# EAGLE schematic ChaosMeter (EAGLE 6.6.0)

## Sheet 1 of 6
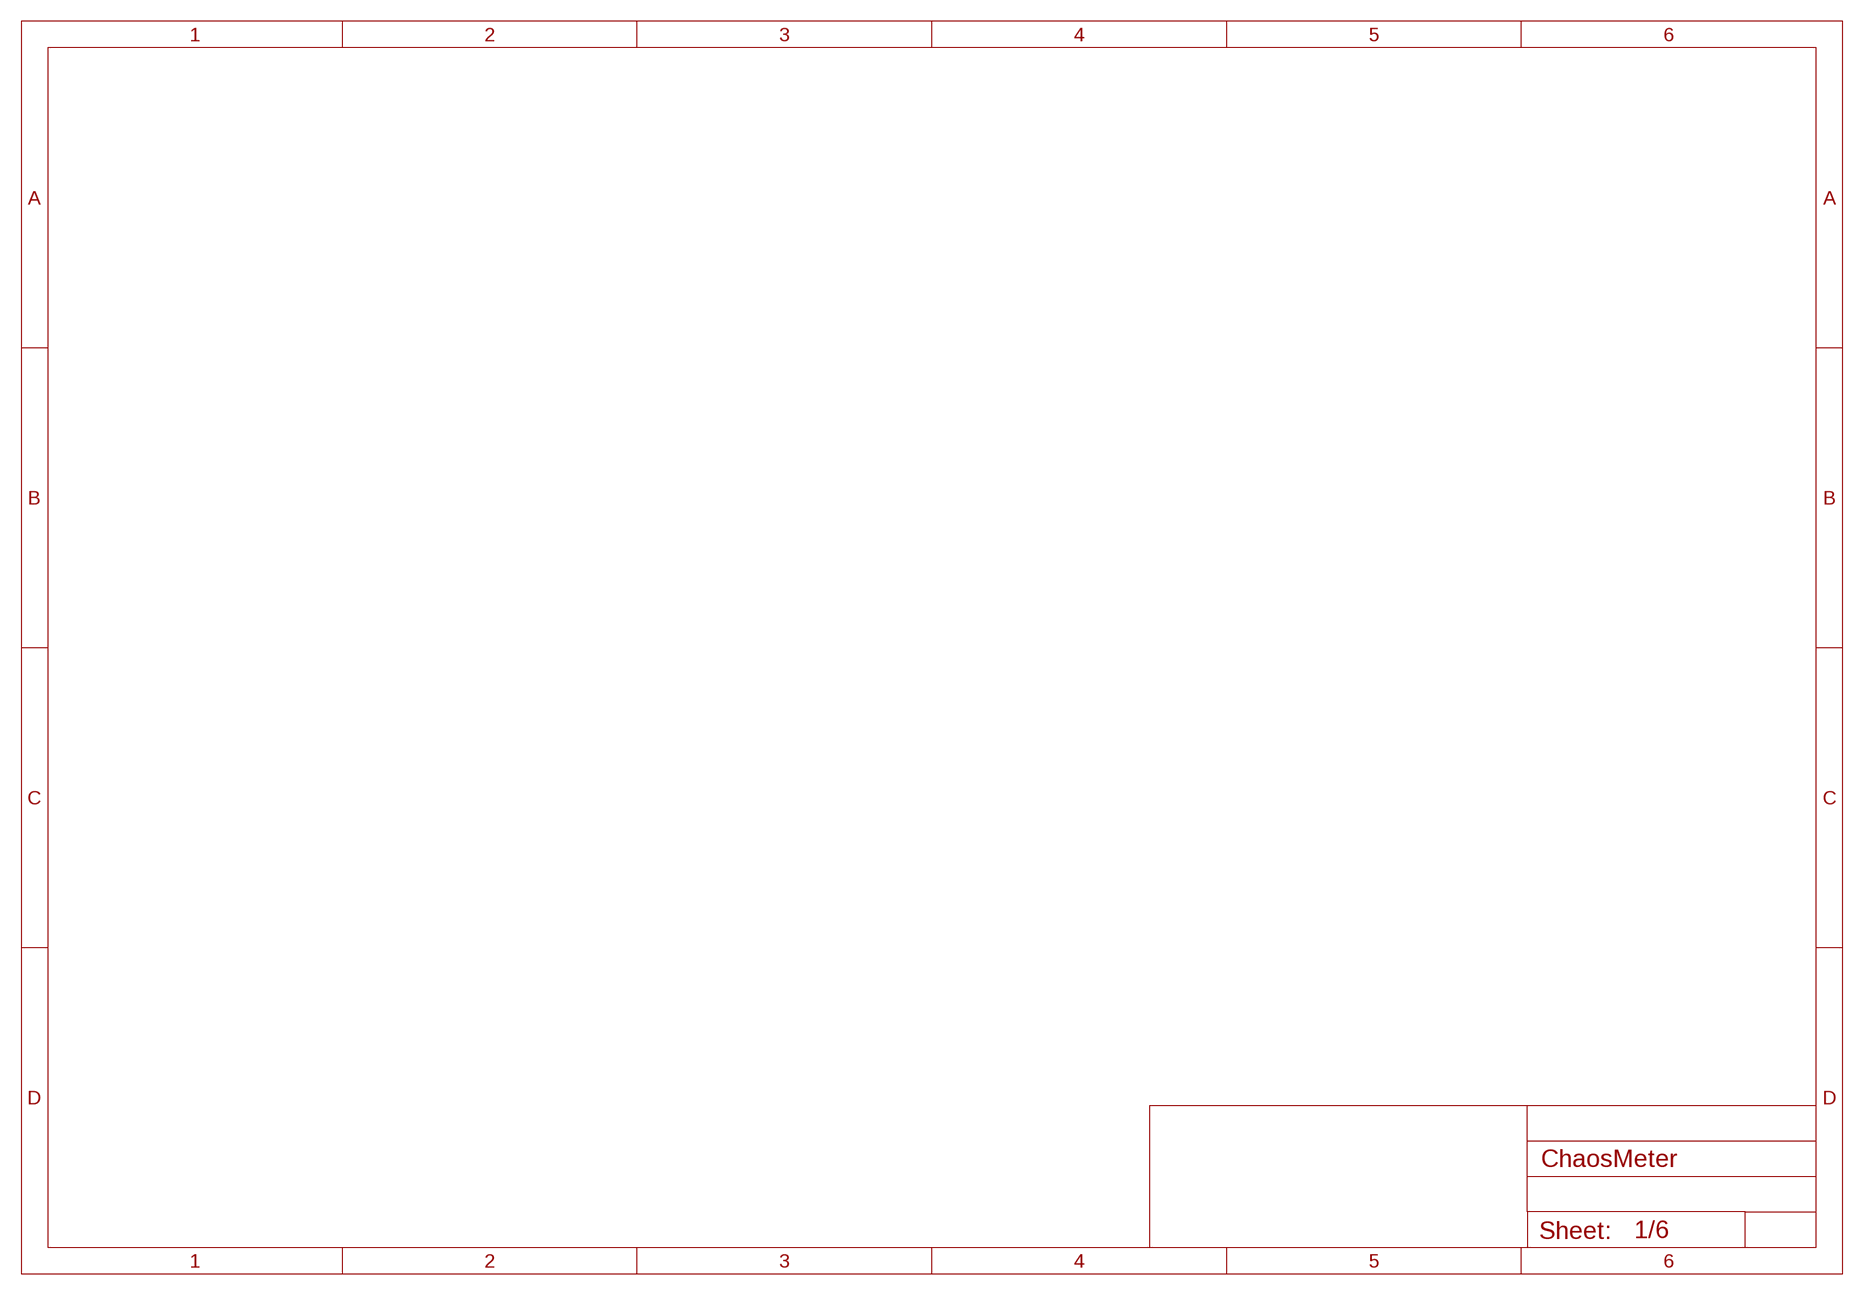
[diagram p0: schematic, sheet 1]

## Sheet 2 of 6
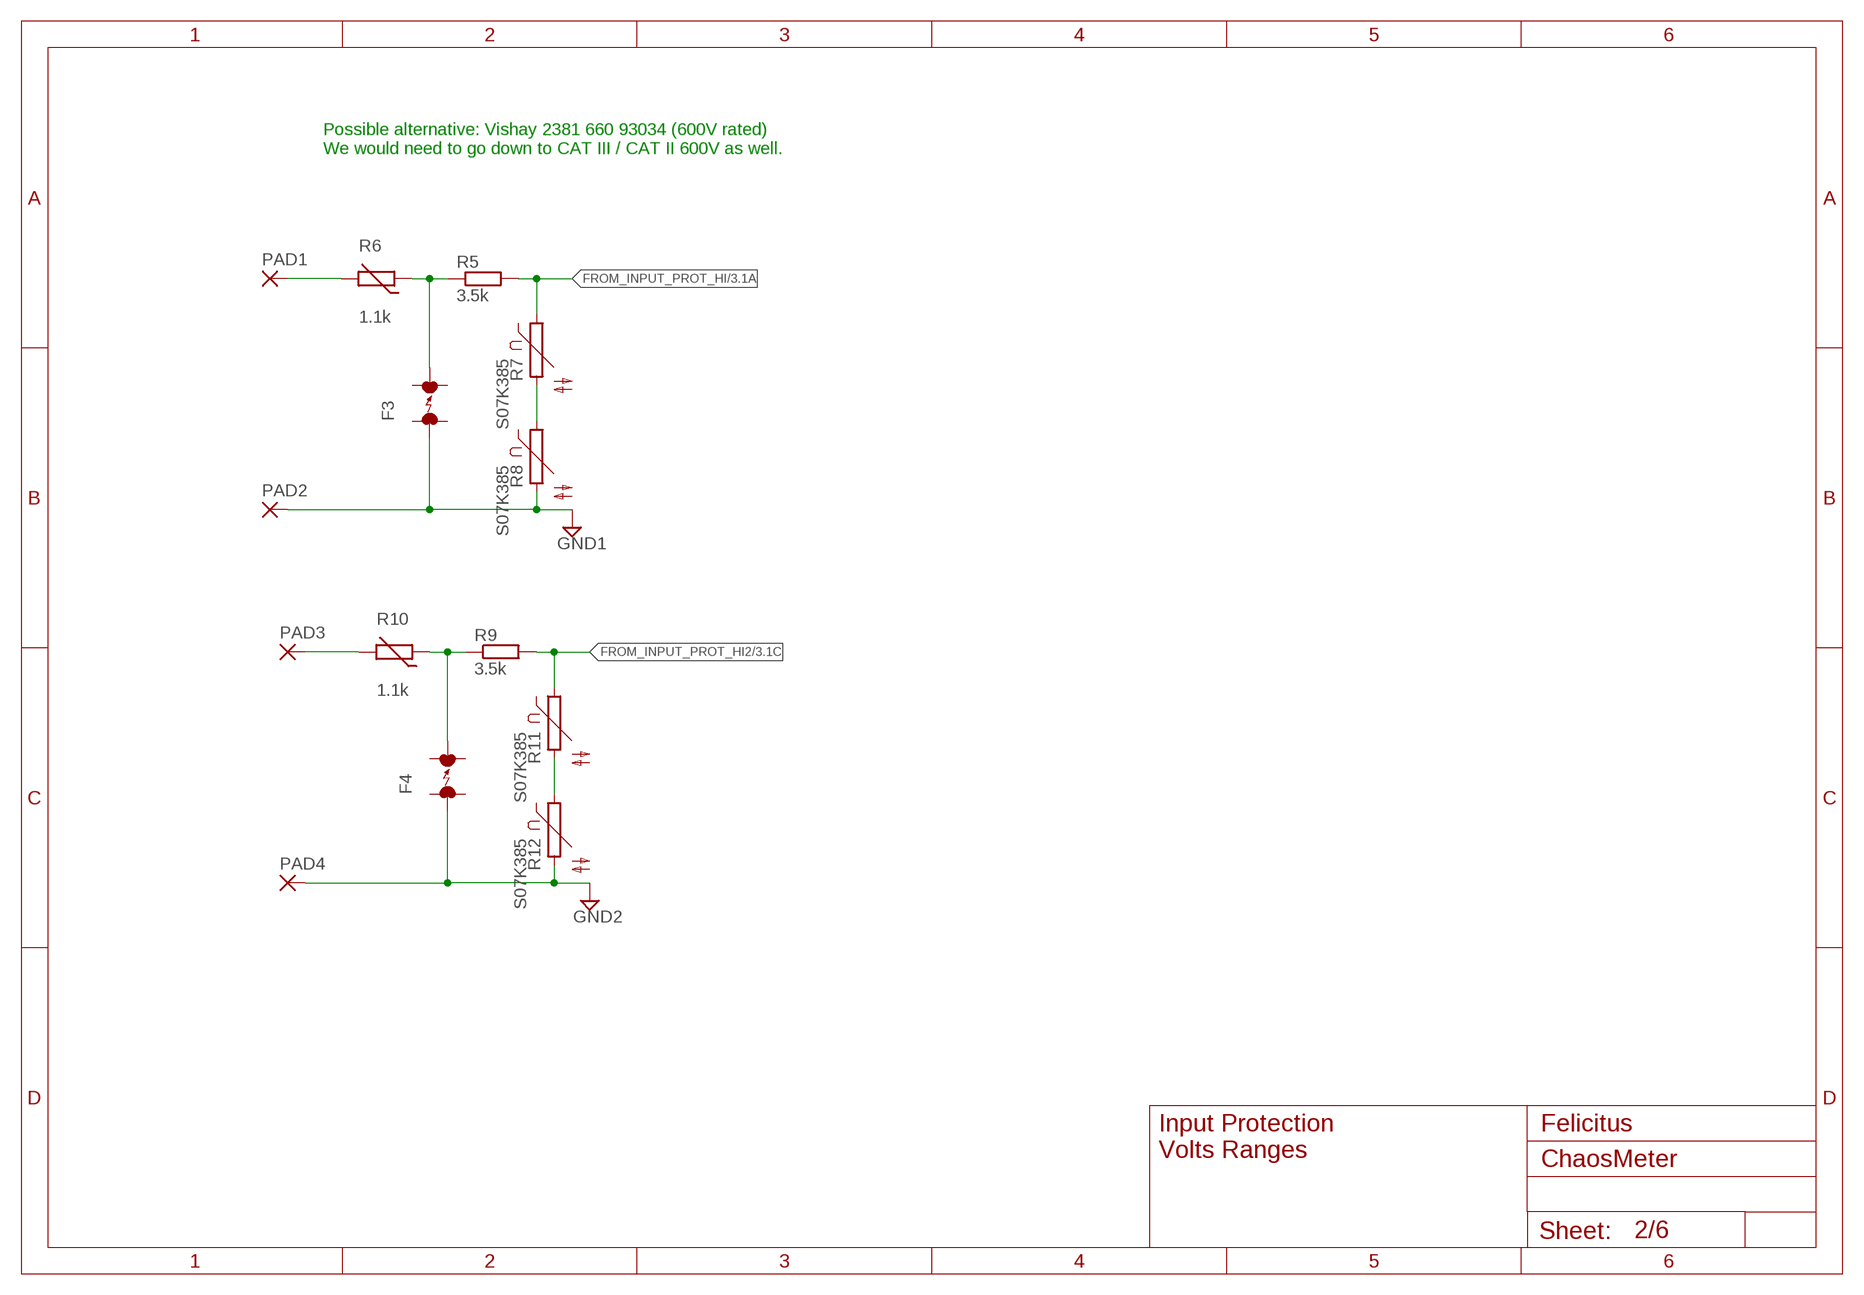
[diagram p1: schematic, sheet 2]

### Parts
F3  ARRESTER  [EPCOS_N81]
F4  ARRESTER  [EPCOS_N81]
PAD1  2,54/1,1  [2,54/1,1]
PAD2  2,54/1,1  [2,54/1,1]
PAD3  2,54/1,1  [2,54/1,1]
PAD4  2,54/1,1  [2,54/1,1]
R5  3.5k  R-EU_0613/15  [P0613/15]
R6  1.1k  THERMISTOR-5  [R-5]
R7  S07K385  [S07K385]
R8  S07K385  [S07K385]
R9  3.5k  R-EU_0613/15  [P0613/15]
R10  1.1k  THERMISTOR-5  [R-5]
R11  S07K385  [S07K385]
R12  S07K385  [S07K385]

### Nets
FROM_INPUT_PROT_HI: R5.2 R7.1 ; also sheet 3
FROM_INPUT_PROT_HI2: R9.2 R11.1 ; also sheet 3
GND1: F3.1 PAD2.1(P) R8.2 ; also sheet 3
GND2: F4.1 PAD4.1(P) R12.2 ; also sheet 3
INPUT_JACK_HI: PAD1.1(P) R6.2
INPUT_JACK_HI1: PAD3.1(P) R10.2
N$9: F3.2 R5.1 R6.1
N$14: R11.2 R12.1
N$21: R7.2 R8.1
N$22: F4.2 R9.1 R10.1

### Notes on the sheet
- Possible alternative: Vishay 2381 660 93034 (600V rated)
  We would need to go down to CAT III / CAT II 600V as well.
- Input Protection
  Volts Ranges
- Felicitus

## Sheet 3 of 6: Input Section V/Ohms
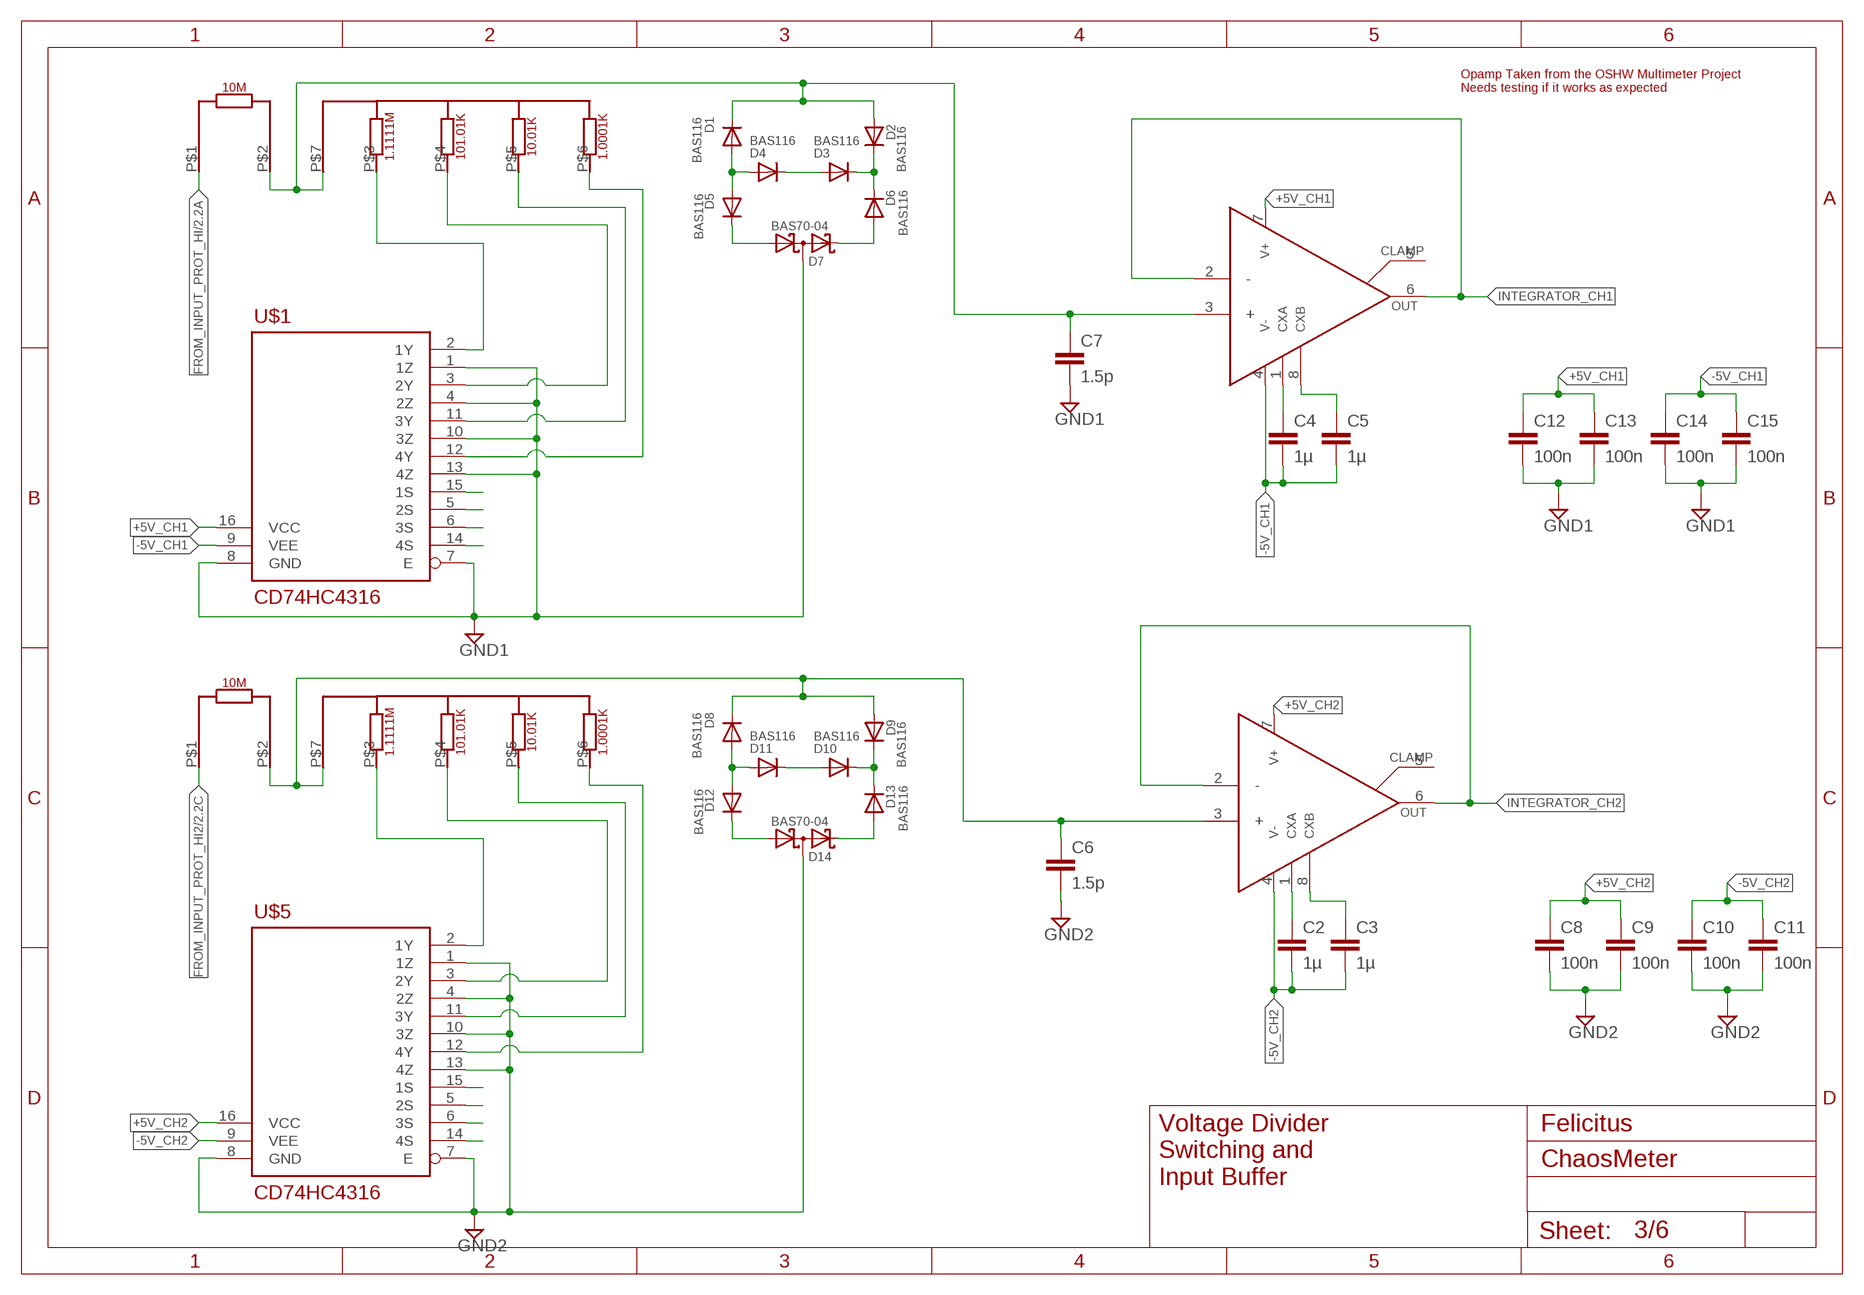
[diagram p2: schematic, sheet 3]

### Parts
C2  1µ  C-EUC0603  [C0603]
C3  1µ  C-EUC0603  [C0603]
C4  1µ  C-EUC0603  [C0603]
C5  1µ  C-EUC0603  [C0603]
C6  1.5p  C-EUC0603  [C0603]
C7  1.5p  C-EUC0603  [C0603]
C8  100n  C-EUC0603  [C0603]
C9  100n  C-EUC0603  [C0603]
C10  100n  C-EUC0603  [C0603]
C11  100n  C-EUC0603  [C0603]
C12  100n  C-EUC0603  [C0603]
C13  100n  C-EUC0603  [C0603]
C14  100n  C-EUC0603  [C0603]
C15  100n  C-EUC0603  [C0603]
D1  BAS116  DIODESOT23  [SOT23-3]
D2  BAS116  DIODESOT23  [SOT23-3]
D3  BAS116  DIODESOT23  [SOT23-3]
D4  BAS116  DIODESOT23  [SOT23-3]
D5  BAS116  DIODESOT23  [SOT23-3]
D6  BAS116  DIODESOT23  [SOT23-3]
D7  BAS70-04  [SOT23]
D8  BAS116  DIODESOT23  [SOT23-3]
D9  BAS116  DIODESOT23  [SOT23-3]
D10  BAS116  DIODESOT23  [SOT23-3]
D11  BAS116  DIODESOT23  [SOT23-3]
D12  BAS116  DIODESOT23  [SOT23-3]
D13  BAS116  DIODESOT23  [SOT23-3]
D14  BAS70-04  [SOT23]
U$1  CD74HC4316  [SOP65P640X110-16N]
U$3  CADDOCK-1776-C4815  [CADDOCK-1776-C4815]
U$4  CADDOCK-1776-C4815  [CADDOCK-1776-C4815]
U$5  CD74HC4316  [SOP65P640X110-16N]
U$6  TLC2654A  [SOIC8]
U$7  TLC2654A  [SOIC8]

### Nets
+5V_CH1: C12.1 C13.1 U$1.16(VCC) U$7.7(V+)
+5V_CH2: C8.1 C9.1 U$5.16(VCC) U$6.7(V+)
-5V_CH1: C4.2 C5.2 C14.1 C15.1 U$1.9(VEE) U$7.4(V-)
-5V_CH2: C2.2 C3.2 C10.1 C11.1 U$5.9(VEE) U$6.4(V-)
FROM_INPUT_PROT_HI: U$3.P$1 ; also sheet 2
FROM_INPUT_PROT_HI2: U$4.P$1 ; also sheet 2
GND1: C7.2 C12.2 C13.2 C14.2 C15.2 D7.3(C1A2) U$1.1(1Z) U$1.4(2Z) U$1.7(E) U$1.8(GND) U$1.10(3Z) U$1.13(4Z) ; also sheet 2
GND2: C6.2 C8.2 C9.2 C10.2 C11.2 D14.3(C1A2) U$5.1(1Z) U$5.4(2Z) U$5.7(E) U$5.8(GND) U$5.10(3Z) U$5.13(4Z) ; also sheet 2
INTEGRATOR_CH1: U$7.6(OUT)
INTEGRATOR_CH2: U$6.6(OUT)
N$1: D3.1(A) D4.3(C)
N$2: D2.3(C) D3.3(C) D6.3(C)
N$3: D1.1(A) D4.1(A) D5.1(A)
N$4: D5.3(C) D7.1(A1)
N$5: D6.1(A) D7.2(C2)
N$6: D10.1(A) D11.3(C)
N$7: C7.1 D1.3(C) D2.1(A) U$3.P$2 U$3.P$7 U$7.3(+)
N$8: U$1.2(1Y) U$3.P$3
N$10: D9.3(C) D10.3(C) D13.3(C)
N$11: U$1.3(2Y) U$3.P$4
N$12: U$1.11(3Y) U$3.P$5
N$13: U$1.12(4Y) U$3.P$6
N$15: U$1.15(1S)
N$16: U$1.5(2S)
N$17: U$1.6(3S)
N$18: U$1.14(4S)
N$19: D8.1(A) D11.1(A) D12.1(A)
N$20: D12.3(C) D14.1(A1)
N$23: D13.1(A) D14.2(C2)
N$24: C6.1 D8.3(C) D9.1(A) U$4.P$2 U$4.P$7 U$6.3(+)
N$25: U$4.P$3 U$5.2(1Y)
N$26: U$4.P$4 U$5.3(2Y)
N$27: U$4.P$5 U$5.11(3Y)
N$28: U$4.P$6 U$5.12(4Y)
N$29: U$5.15(1S)
N$30: U$5.5(2S)
N$31: U$5.6(3S)
N$32: U$5.14(4S)
N$34: C2.1 U$6.1(CXA)
N$35: U$6.2(-)
N$37: C3.1 U$6.8(CXB)
N$41: U$7.2(-)
N$43: C4.1 U$7.1(CXA)
N$44: C5.1 U$7.8(CXB)
Unconnected: U$6.5(CLAMP) U$7.5(CLAMP)

### Notes on the sheet
- Opamp Taken from the OSHW Multimeter Project
  Needs testing if it works as expected
- Voltage Divider
  Switching and
  Input Buffer
- Felicitus

## Sheet 4 of 6: Display Section
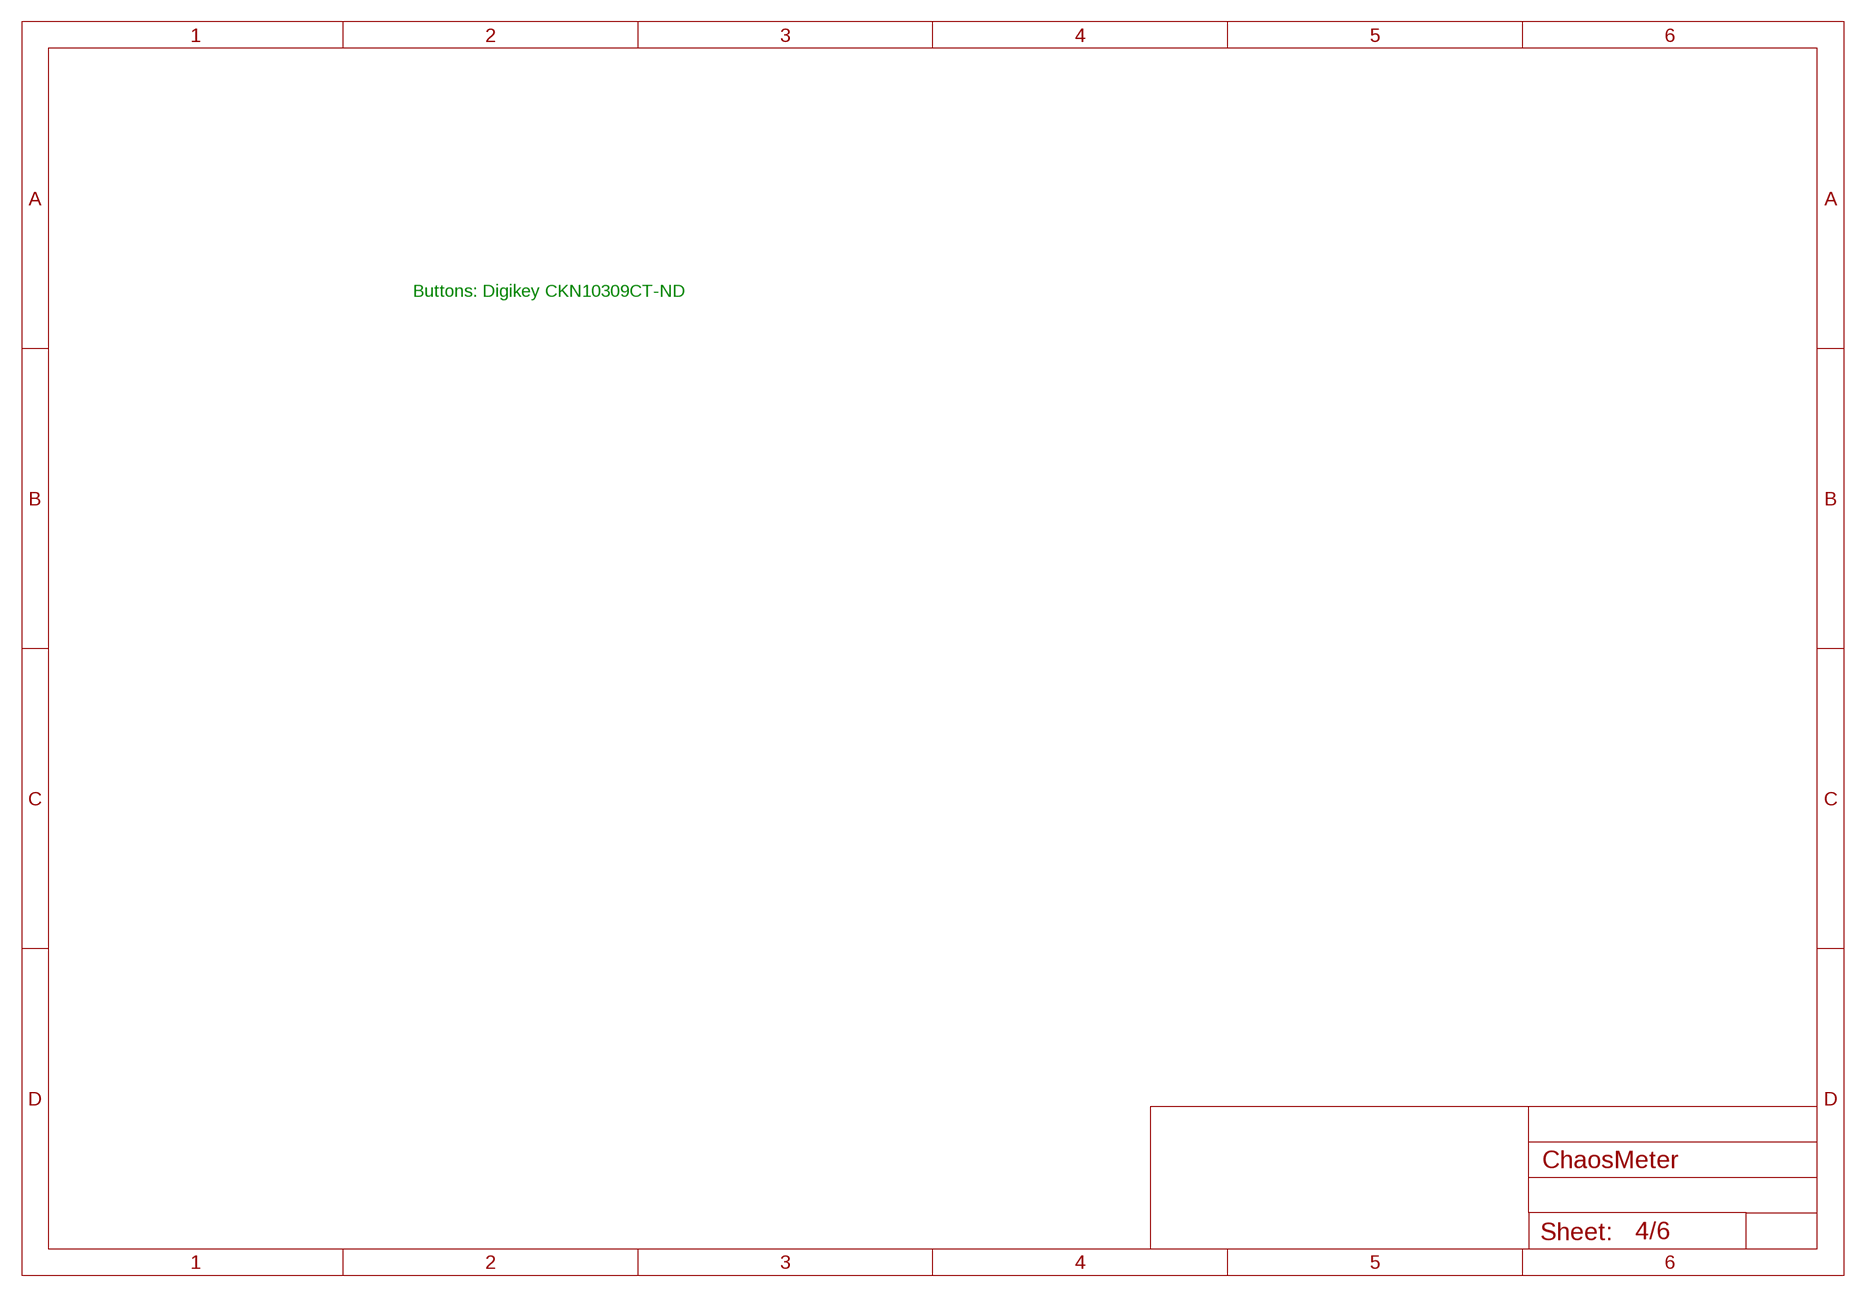
[diagram p3: schematic, sheet 4, part 1 of 2]
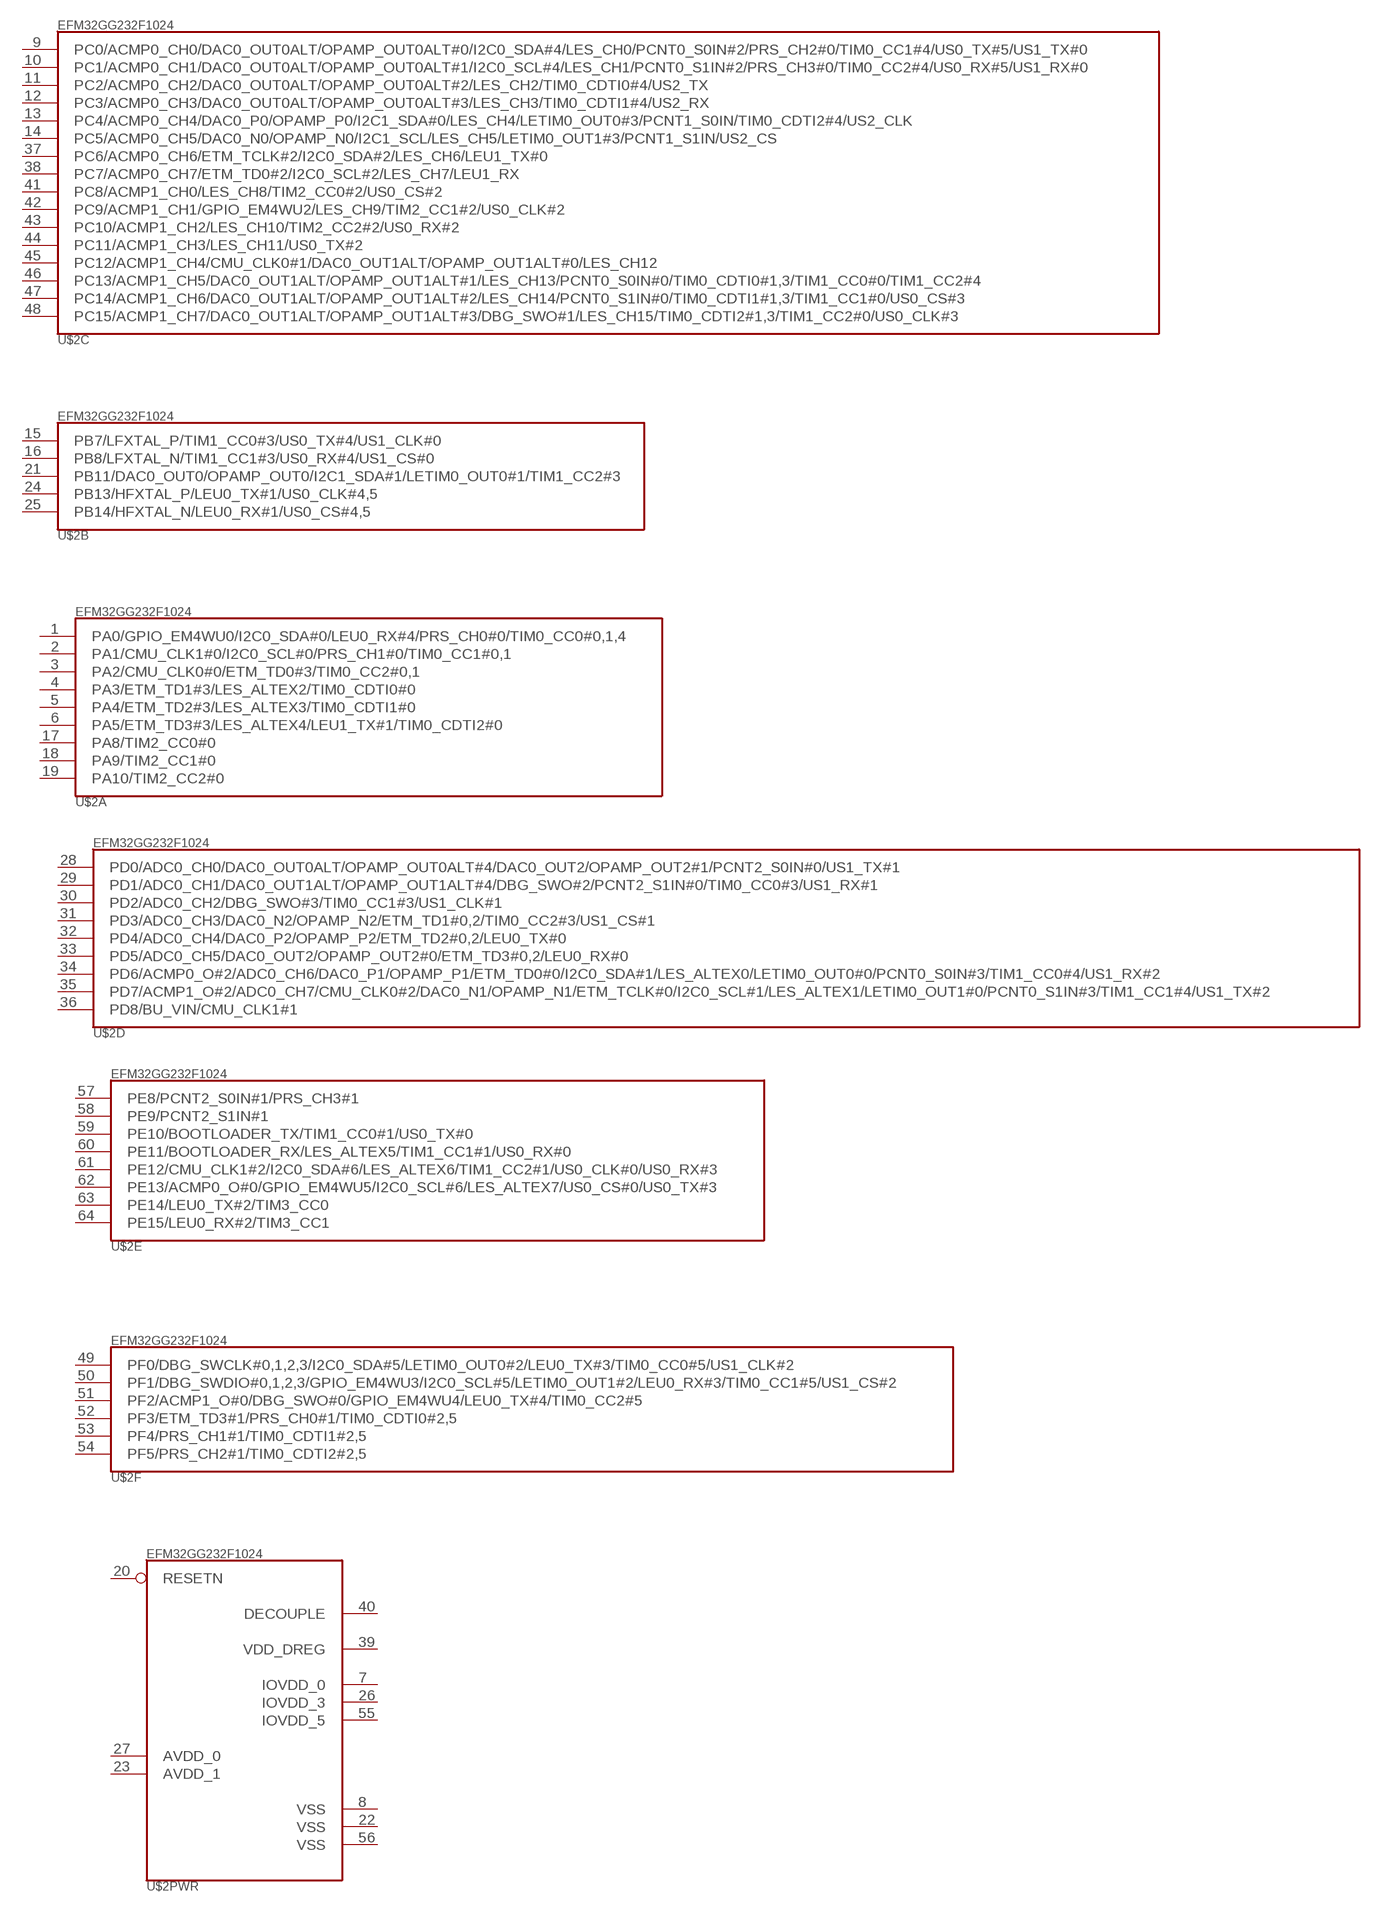
[diagram p4: schematic, sheet 4, part 2 of 2]

### Parts
U$2  EFM32GG232F1024  [QFP64]
Unconnected: U$2.1(A:PA0/GPIO_EM4WU0/I2C0_SDA#0/LEU0_RX#4/PRS_CH0#0/TIM0_CC0#0,1,4) U$2.2(A:PA1/CMU_CLK1#0/I2C0_SCL#0/PRS_CH1#0/TIM0_CC1#0,1) U$2.3(A:PA2/CMU_CLK0#0/ETM_TD0#3/TIM0_CC2#0,1) U$2.4(A:PA3/ETM_TD1#3/LES_ALTEX2/TIM0_CDTI0#0) U$2.5(A:PA4/ETM_TD2#3/LES_ALTEX3/TIM0_CDTI1#0) U$2.6(A:PA5/ETM_TD3#3/LES_ALTEX4/LEU1_TX#1/TIM0_CDTI2#0) U$2.9(C:PC0/ACMP0_CH0/DAC0_OUT0ALT/OPAMP_OUT0ALT#0/I2C0_SDA#4/LES_CH0/PCNT0_S0IN#2/PRS_CH2#0/TIM0_CC1#4/US0_TX#5/US1_TX#0) U$2.10(C:PC1/ACMP0_CH1/DAC0_OUT0ALT/OPAMP_OUT0ALT#1/I2C0_SCL#4/LES_CH1/PCNT0_S1IN#2/PRS_CH3#0/TIM0_CC2#4/US0_RX#5/US1_RX#0) U$2.11(C:PC2/ACMP0_CH2/DAC0_OUT0ALT/OPAMP_OUT0ALT#2/LES_CH2/TIM0_CDTI0#4/US2_TX) U$2.12(C:PC3/ACMP0_CH3/DAC0_OUT0ALT/OPAMP_OUT0ALT#3/LES_CH3/TIM0_CDTI1#4/US2_RX) U$2.13(C:PC4/ACMP0_CH4/DAC0_P0/OPAMP_P0/I2C1_SDA#0/LES_CH4/LETIM0_OUT0#3/PCNT1_S0IN/TIM0_CDTI2#4/US2_CLK) U$2.14(C:PC5/ACMP0_CH5/DAC0_N0/OPAMP_N0/I2C1_SCL/LES_CH5/LETIM0_OUT1#3/PCNT1_S1IN/US2_CS) U$2.15(B:PB7/LFXTAL_P/TIM1_CC0#3/US0_TX#4/US1_CLK#0) U$2.16(B:PB8/LFXTAL_N/TIM1_CC1#3/US0_RX#4/US1_CS#0) U$2.17(A:PA8/TIM2_CC0#0) U$2.18(A:PA9/TIM2_CC1#0) U$2.19(A:PA10/TIM2_CC2#0) U$2.20(PWR:RESETN) U$2.21(B:PB11/DAC0_OUT0/OPAMP_OUT0/I2C1_SDA#1/LETIM0_OUT0#1/TIM1_CC2#3) U$2.24(B:PB13/HFXTAL_P/LEU0_TX#1/US0_CLK#4,5) U$2.25(B:PB14/HFXTAL_N/LEU0_RX#1/US0_CS#4,5) U$2.28(D:PD0/ADC0_CH0/DAC0_OUT0ALT/OPAMP_OUT0ALT#4/DAC0_OUT2/OPAMP_OUT2#1/PCNT2_S0IN#0/US1_TX#1) U$2.29(D:PD1/ADC0_CH1/DAC0_OUT1ALT/OPAMP_OUT1ALT#4/DBG_SWO#2/PCNT2_S1IN#0/TIM0_CC0#3/US1_RX#1) U$2.30(D:PD2/ADC0_CH2/DBG_SWO#3/TIM0_CC1#3/US1_CLK#1) U$2.31(D:PD3/ADC0_CH3/DAC0_N2/OPAMP_N2/ETM_TD1#0,2/TIM0_CC2#3/US1_CS#1) U$2.32(D:PD4/ADC0_CH4/DAC0_P2/OPAMP_P2/ETM_TD2#0,2/LEU0_TX#0) U$2.33(D:PD5/ADC0_CH5/DAC0_OUT2/OPAMP_OUT2#0/ETM_TD3#0,2/LEU0_RX#0) U$2.34(D:PD6/ACMP0_O#2/ADC0_CH6/DAC0_P1/OPAMP_P1/ETM_TD0#0/I2C0_SDA#1/LES_ALTEX0/LETIM0_OUT0#0/PCNT0_S0IN#3/TIM1_CC0#4/US1_RX#2) U$2.35(D:PD7/ACMP1_O#2/ADC0_CH7/CMU_CLK0#2/DAC0_N1/OPAMP_N1/ETM_TCLK#0/I2C0_SCL#1/LES_ALTEX1/LETIM0_OUT1#0/PCNT0_S1IN#3/TIM1_CC1#4/US1_TX#2) U$2.36(D:PD8/BU_VIN/CMU_CLK1#1) U$2.37(C:PC6/ACMP0_CH6/ETM_TCLK#2/I2C0_SDA#2/LES_CH6/LEU1_TX#0) U$2.38(C:PC7/ACMP0_CH7/ETM_TD0#2/I2C0_SCL#2/LES_CH7/LEU1_RX) U$2.41(C:PC8/ACMP1_CH0/LES_CH8/TIM2_CC0#2/US0_CS#2) U$2.42(C:PC9/ACMP1_CH1/GPIO_EM4WU2/LES_CH9/TIM2_CC1#2/US0_CLK#2) U$2.43(C:PC10/ACMP1_CH2/LES_CH10/TIM2_CC2#2/US0_RX#2) U$2.44(C:PC11/ACMP1_CH3/LES_CH11/US0_TX#2) U$2.45(C:PC12/ACMP1_CH4/CMU_CLK0#1/DAC0_OUT1ALT/OPAMP_OUT1ALT#0/LES_CH12) U$2.46(C:PC13/ACMP1_CH5/DAC0_OUT1ALT/OPAMP_OUT1ALT#1/LES_CH13/PCNT0_S0IN#0/TIM0_CDTI0#1,3/TIM1_CC0#0/TIM1_CC2#4) U$2.47(C:PC14/ACMP1_CH6/DAC0_OUT1ALT/OPAMP_OUT1ALT#2/LES_CH14/PCNT0_S1IN#0/TIM0_CDTI1#1,3/TIM1_CC1#0/US0_CS#3) U$2.48(C:PC15/ACMP1_CH7/DAC0_OUT1ALT/OPAMP_OUT1ALT#3/DBG_SWO#1/LES_CH15/TIM0_CDTI2#1,3/TIM1_CC2#0/US0_CLK#3) U$2.49(F:PF0/DBG_SWCLK#0,1,2,3/I2C0_SDA#5/LETIM0_OUT0#2/LEU0_TX#3/TIM0_CC0#5/US1_CLK#2) U$2.50(F:PF1/DBG_SWDIO#0,1,2,3/GPIO_EM4WU3/I2C0_SCL#5/LETIM0_OUT1#2/LEU0_RX#3/TIM0_CC1#5/US1_CS#2) U$2.51(F:PF2/ACMP1_O#0/DBG_SWO#0/GPIO_EM4WU4/LEU0_TX#4/TIM0_CC2#5) U$2.52(F:PF3/ETM_TD3#1/PRS_CH0#1/TIM0_CDTI0#2,5) U$2.53(F:PF4/PRS_CH1#1/TIM0_CDTI1#2,5) U$2.54(F:PF5/PRS_CH2#1/TIM0_CDTI2#2,5) U$2.57(E:PE8/PCNT2_S0IN#1/PRS_CH3#1) U$2.58(E:PE9/PCNT2_S1IN#1) U$2.59(E:PE10/BOOTLOADER_TX/TIM1_CC0#1/US0_TX#0) U$2.60(E:PE11/BOOTLOADER_RX/LES_ALTEX5/TIM1_CC1#1/US0_RX#0) U$2.61(E:PE12/CMU_CLK1#2/I2C0_SDA#6/LES_ALTEX6/TIM1_CC2#1/US0_CLK#0/US0_RX#3) U$2.62(E:PE13/ACMP0_O#0/GPIO_EM4WU5/I2C0_SCL#6/LES_ALTEX7/US0_CS#0/US0_TX#3) U$2.63(E:PE14/LEU0_TX#2/TIM3_CC0) U$2.64(E:PE15/LEU0_RX#2/TIM3_CC1)

### Notes on the sheet
- Buttons: Digikey CKN10309CT-ND

## Sheet 5 of 6

## Sheet 6 of 6: Amps Input
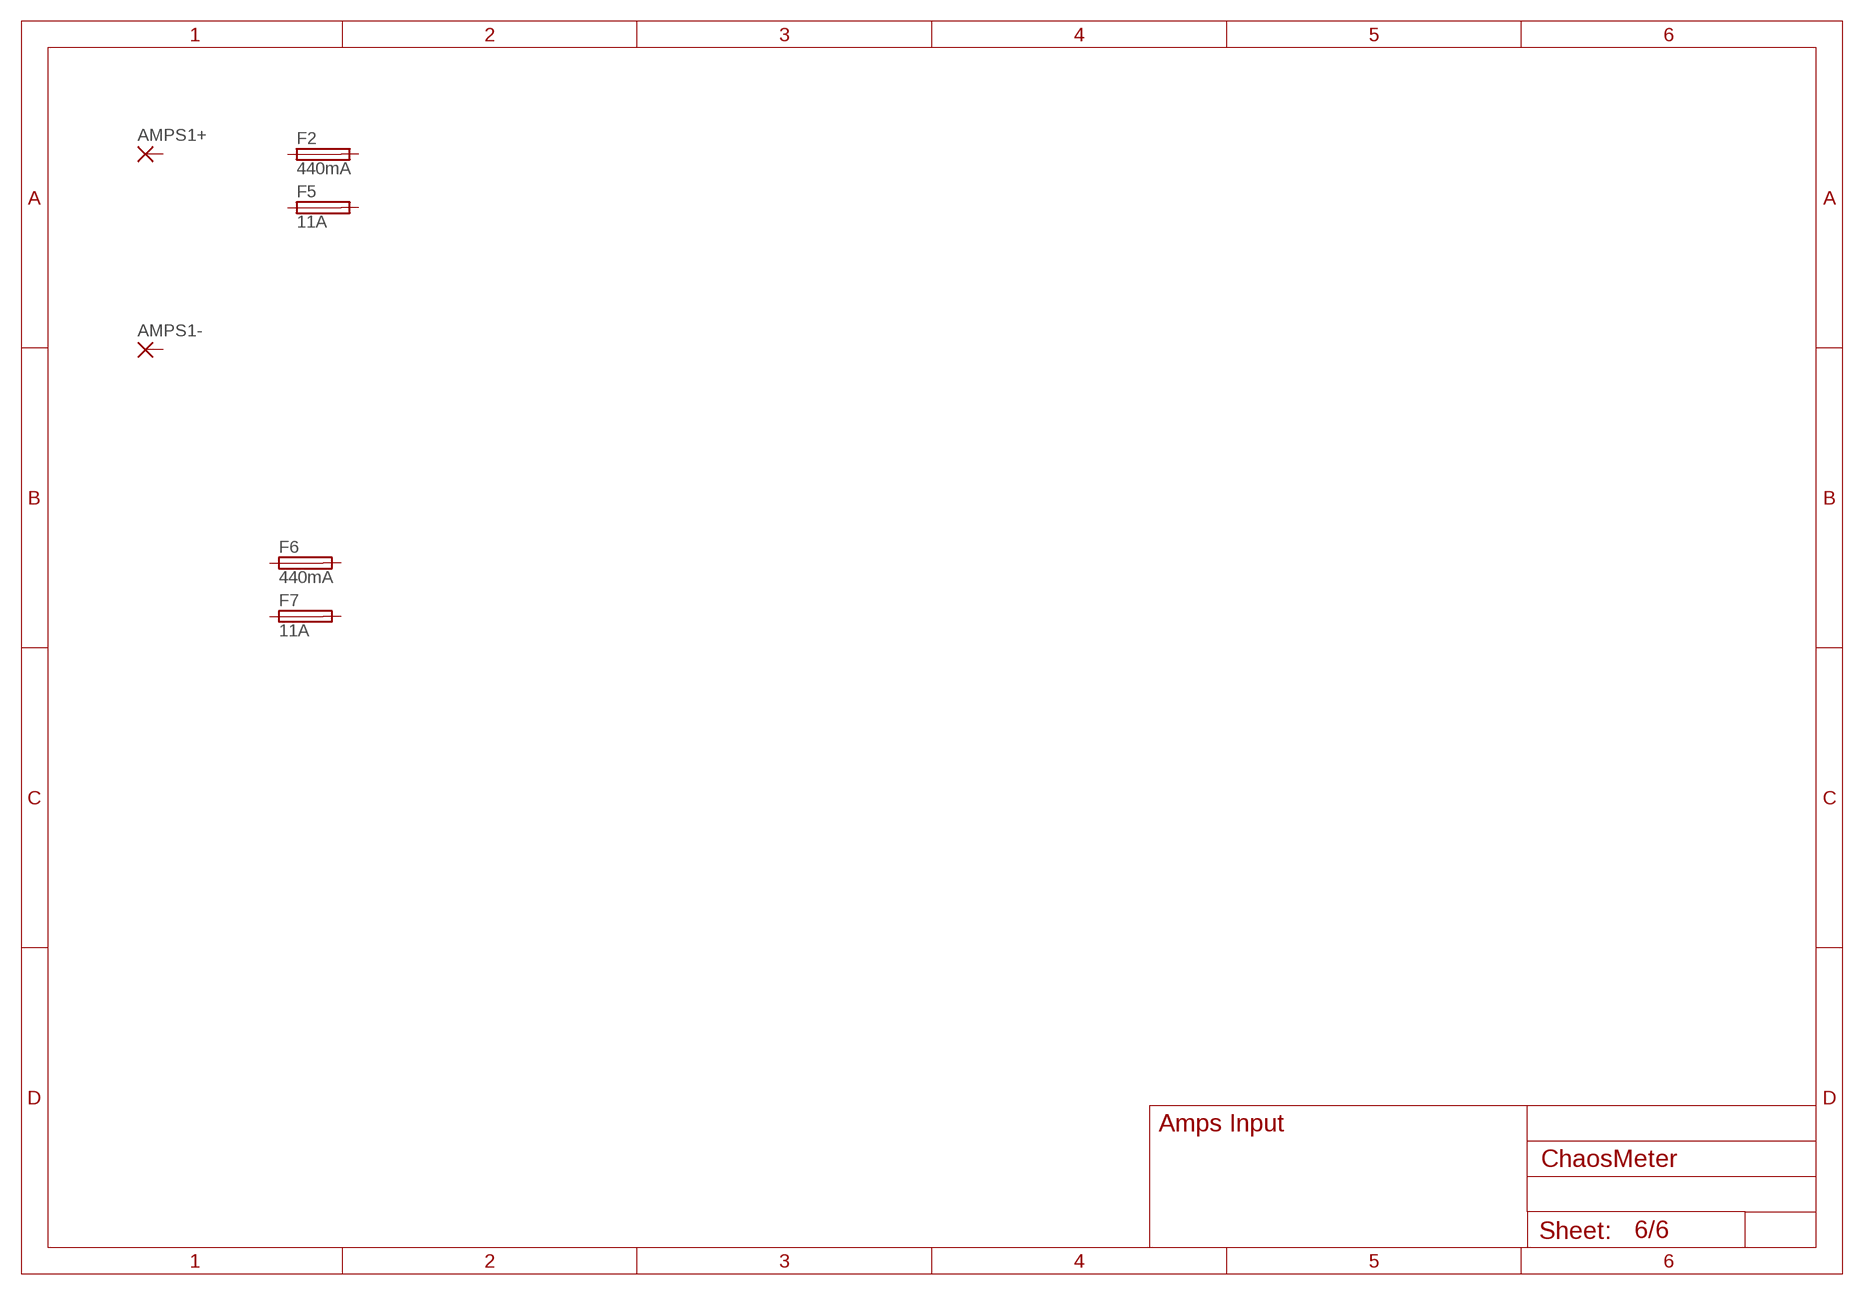
[diagram p5: schematic, sheet 6]

### Parts
AMPS1+  2,54/1,1  [2,54/1,1]
AMPS1-  2,54/1,1  [2,54/1,1]
F2  440mA  FUSESH32  [SH32]
F5  11A  FUSESH32  [SH32]
F6  440mA  FUSESH32  [SH32]
F7  11A  FUSESH32  [SH32]
Unconnected: AMPS1+.1(P) AMPS1-.1(P) F2.1A F2.2A F5.1A F5.2A F6.1A F6.2A F7.1A F7.2A

### Notes on the sheet
- Amps Input

## Power pins joined to a net without a drawn wire
AVDD_0: U$2.27(PWR:AVDD_0)
AVDD_1: U$2.23(PWR:AVDD_1)
DECOUPLE: U$2.40(PWR:DECOUPLE)
IOVDD_0: U$2.7(PWR:IOVDD_0)
IOVDD_3: U$2.26(PWR:IOVDD_3)
IOVDD_5: U$2.55(PWR:IOVDD_5)
VDD_DREG: U$2.39(PWR:VDD_DREG)
VSS: U$2.8(PWR:VSS) U$2.22(PWR:VSS) U$2.56(PWR:VSS)

## Library data of the parts
AMPS1+ AMPS1- PAD1-PAD4 = wirepad:2,54/1,1: THROUGH-HOLE PAD
C2-C15 = rcl:C-EU: CAPACITOR, European symbol
D1-D6 D8-D13 = SparkFun:DIODE: Diode These are standard reverse protection diodes and small signal diodes. SMA package can handle up to about 1A. SOD-323 can handle about 200mA. What the SOD-323 package when ordering, there are some mfgs out there that are 5-pin packages.; OC_DIGIKEY: BAS116-FDICT-ND; PR_DIGIKEY: 0.18
D7 D14 = diode:BAS70-04: Silicon Schottky Diodes General-purpose diode for high-speed switching
F2 F5-F7 = fuse:FUSE: Fuse; OC_FARNELL: unknown; OC_NEWARK: unknown
F3 F4 = discrete:ARRESTER: GASENTLADUNGSABLEITER 90V 10KA DC-Überschlag: 90V; Spannung, Impulsüberschlag: < 600V; Strom, Pulsentlastung, max.: 10kA Source: http://de.farnell.com .. 4025.pdf
R5 R9 = rcl:R-EU_: RESISTOR, European symbol; OC_DIGIKEY: ALSR3J-3.5K-ND
R6 R10 = varistor:THERMISTOR: THERMISTOR; OC_FARNELL: 92C1837
R7 R8 R11 R12 = varistor:S07K385: VARISTOR; OC_DIGIKEY: P16665-ND
U$1 U$5 = AnalogSwitches:CD74HC4316
U$2 = EnergyMicro:EFM32GG232F1024: EFM32GG232F1024 Gecko Microcontroller in 10mm x 10mm QFP64 package
U$3 U$4 = CADDOCK-1776:CADDOCK-1776-C4815
U$6 U$7 = AnalogSwitches:TLC2654A